# Altium schematic sheet VREG_CCU_HAS.SchDoc: CCU - Voltage Regulation
size B; DrawnBy: M. Seago; Organization: Gravitas; Address1: Sponsored By:; Address2: Alan Morgan; Address3: Technical Advisor:; Address4: Dr. Joseph Morgan; Revision: 1A; SheetNumber: 2; SheetTotal: 9
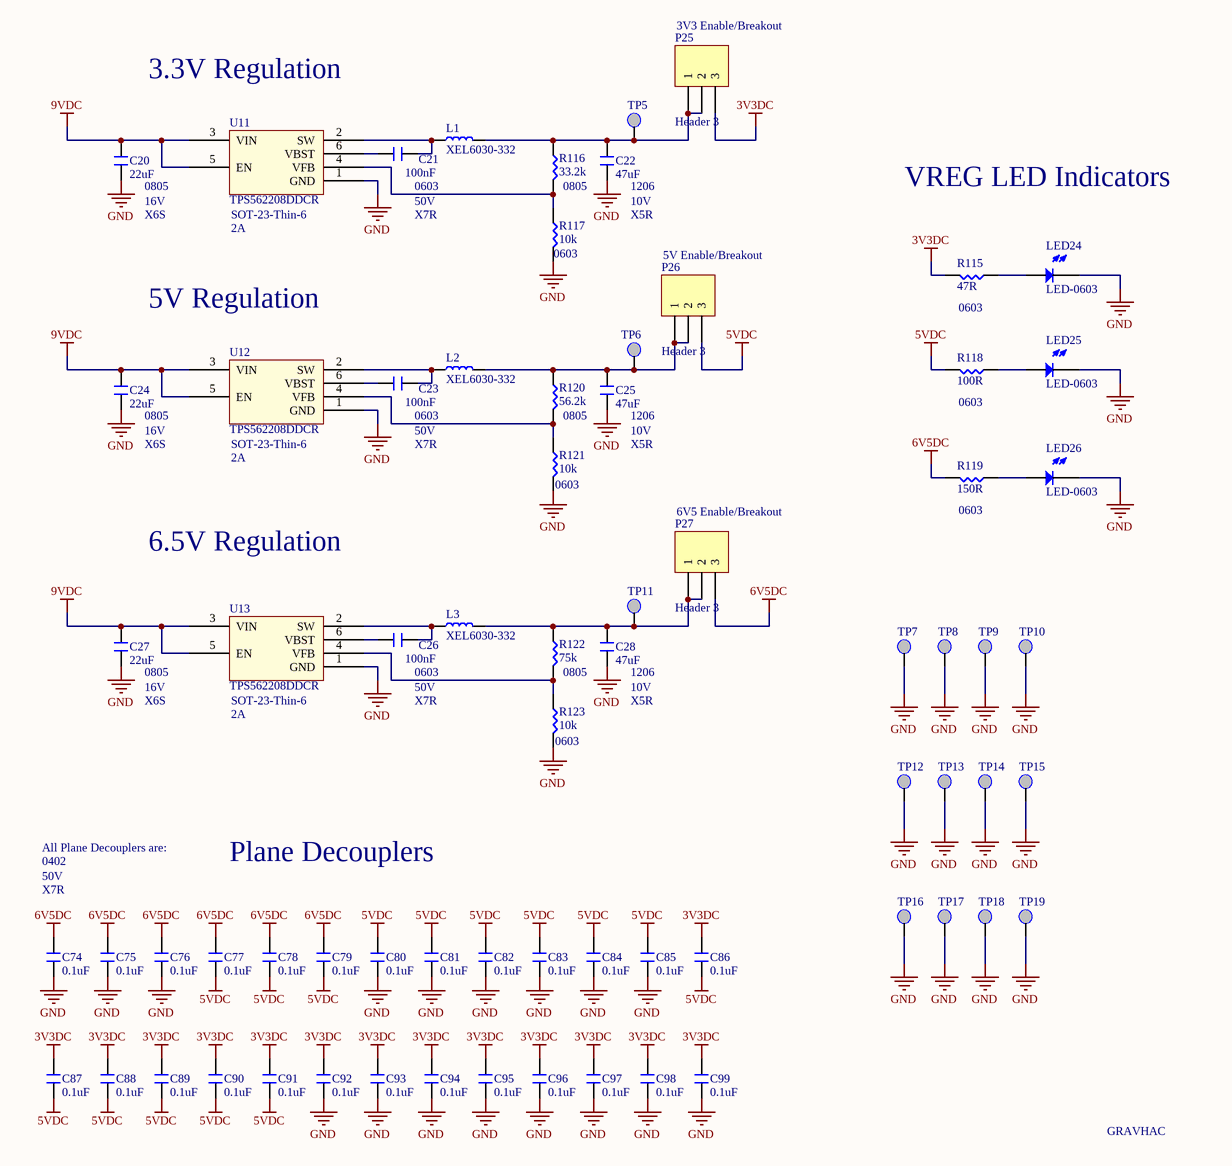
[diagram p0: VREG_CCU_HAS.SchDoc]

## Parts
C20  22uF  [NonPolar-0805]
C21  100nF  [NonPolar-0603]
C22  47uF  [NONPOLAR-1206]
C23  100nF  [NonPolar-0603]
C24  22uF  [NonPolar-0805]
C25  47uF  [NONPOLAR-1206]
C26  100nF  [NonPolar-0603]
C27  22uF  [NonPolar-0805]
C28  47uF  [NONPOLAR-1206]
C74  0.1uF  [NonPolar-0402]
C75  0.1uF  [NonPolar-0402]
C76  0.1uF  [NonPolar-0402]
C77  0.1uF  [NonPolar-0402]
C78  0.1uF  [NonPolar-0402]
C79  0.1uF  [NonPolar-0402]
C80  0.1uF  [NonPolar-0402]
C81  0.1uF  [NonPolar-0402]
C82  0.1uF  [NonPolar-0402]
C83  0.1uF  [NonPolar-0402]
C84  0.1uF  [NonPolar-0402]
C85  0.1uF  [NonPolar-0402]
C86  0.1uF  [NonPolar-0402]
C87  0.1uF  [NonPolar-0402]
C88  0.1uF  [NonPolar-0402]
C89  0.1uF  [NonPolar-0402]
C90  0.1uF  [NonPolar-0402]
C91  0.1uF  [NonPolar-0402]
C92  0.1uF  [NonPolar-0402]
C93  0.1uF  [NonPolar-0402]
C94  0.1uF  [NonPolar-0402]
C95  0.1uF  [NonPolar-0402]
C96  0.1uF  [NonPolar-0402]
C97  0.1uF  [NonPolar-0402]
C98  0.1uF  [NonPolar-0402]
C99  0.1uF  [NonPolar-0402]
L1  XEL6030-332  [XEL6030-33uH]
L2  XEL6030-332  [XEL6030-33uH]
L3  XEL6030-332  [XEL6030-33uH]
LED24  LED-0603  [LED-0603]
LED25  LED-0603  [LED-0603]
LED26  LED-0603  [LED-0603]
P25  Header 3  [HDR1X3]
P26  Header 3  [HDR1X3]
P27  Header 3  [HDR1X3]
R115  47R  [NonPolar-0603]
R116  33.2k  [NonPolar-0805]
R117  10k  [NonPolar-0603]
R118  100R  [NonPolar-0603]
R119  150R  [NonPolar-0603]
R120  56.2k  [NonPolar-0805]
R121  10k  [NonPolar-0603]
R122  75k  [NonPolar-0805]
R123  10k  [NonPolar-0603]
TP5  TestPoint  [TP - S2751-46R]  (value not drawn)
TP6  TestPoint  [TP - S2751-46R]  (value not drawn)
TP7  TestPoint  [TP - S2751-46R]  (value not drawn)
TP8  TestPoint  [TP - S2751-46R]  (value not drawn)
TP9  TestPoint  [TP - S2751-46R]  (value not drawn)
TP10  TestPoint  [TP - S2751-46R]  (value not drawn)
TP11  TestPoint  [TP - S2751-46R]  (value not drawn)
TP12  TestPoint  [TP - S2751-46R]  (value not drawn)
TP13  TestPoint  [TP - S2751-46R]  (value not drawn)
TP14  TestPoint  [TP - S2751-46R]  (value not drawn)
TP15  TestPoint  [TP - S2751-46R]  (value not drawn)
TP16  TestPoint  [TP - S2751-46R]  (value not drawn)
TP17  TestPoint  [TP - S2751-46R]  (value not drawn)
TP18  TestPoint  [TP - S2751-46R]  (value not drawn)
TP19  TestPoint  [TP - S2751-46R]  (value not drawn)
U11  TPS562208DDCR  [TPS562208DDCR]
U12  TPS562208DDCR  [TPS562208DDCR]
U13  TPS562208DDCR  [TPS562208DDCR]

## Nets
3V3DC: C86.2 C87.2 C88.2 C89.2 C90.2 C91.2 C92.2 C93.2 C94.2 C95.2 C96.2 C97.2 C98.2 C99.2 P25.3 R115.1
5VDC: C77.1 C78.1 C79.1 C80.2 C81.2 C82.2 C83.2 C84.2 C85.2 C86.1 C87.1 C88.1 C89.1 C90.1 C91.1 P26.3 R118.1
6V5DC: C74.2 C75.2 C76.2 C77.2 C78.2 C79.2 P27.3 R119.1
9VDC: C20.2 C24.2 C27.2 U11.3(VIN) U11.5(EN) U12.3(VIN) U12.5(EN) U13.3(VIN) U13.5(EN)
GND: C20.1 C22.1 C24.1 C25.1 C27.1 C28.1 C74.1 C75.1 C76.1 C80.1 C81.1 C82.1 C83.1 C84.1 C85.1 C92.1 C93.1 C94.1 C95.1 C96.1 C97.1 C98.1 C99.1 LED24.2 LED25.2 LED26.2 R117.1 R121.1 R123.1 TP7.1 TP8.1 TP9.1 TP10.1 TP12.1 TP13.1 TP14.1 TP15.1 TP16.1 TP17.1 TP18.1 TP19.1 U11.1(GND) U12.1(GND) U13.1(GND)
NetC21_1: C21.1 U11.6(VBST)
NetC21_2: C21.2 L1.1 U11.2(SW)
NetC22_2: C22.2 L1.2 P25.1 P25.2 R116.2 TP5.1
NetC23_1: C23.1 U12.6(VBST)
NetC23_2: C23.2 L2.1 U12.2(SW)
NetC25_2: C25.2 L2.2 P26.1 P26.2 R120.2 TP6.1
NetC26_1: C26.1 U13.6(VBST)
NetC26_2: C26.2 L3.1 U13.2(SW)
NetC28_2: C28.2 L3.2 P27.1 P27.2 R122.2 TP11.1
NetLED24_1: LED24.1 R115.2
NetLED25_1: LED25.1 R118.2
NetLED26_1: LED26.1 R119.2
NetR116_1: R116.1 R117.2 U11.4(VFB)
NetR120_1: R120.1 R121.2 U12.4(VFB)
NetR122_1: R122.1 R123.2 U13.4(VFB)

## Notes on the sheet
- (near P25) 3V3 Enable/Breakout
- 3.3V Regulation
- (near C20) 0805
- (near C20) 16V
- 0603
- 50V
- (near R116) 0805
- (near C22) 1206
- (near C22) 10V
- VREG LED Indicators
- X6S
- (near U11) SOT-23-Thin-6
- (near U11) 2A
- X7R
- (near R117) 0603
- X5R
- (near P26) 5V Enable/Breakout
- 5V Regulation
- (near R115) 0603
- (near R118) 0603
- (near C24) 0805
- (near C24) 16V
- (near U12) SOT-23-Thin-6
- (near U12) 2A
- (near R120) 0805
- (near C25) 1206
- (near C25) 10V
- (near R121) 0603
- (near P27) 6V5 Enable/Breakout
- (near R119) 0603
- 6.5V Regulation
- (near C27) 0805
- (near R122) 0805
- (near C28) 1206
- (near C27) 16V
- (near U13) SOT-23-Thin-6
- (near U13) 2A
- (near R123) 0603
- (near C28) 10V
- 0402
- All Plane Decouplers are:
- Plane Decouplers
- GRAVHAC
- Title
- Size:
- Date:
- B
- Drawn By:
- Revision:
- Sheet
- of
- File:

## Library data of the parts
C20 C24 C27 = Cap - 0805
C21 C23 C26 = Cap - 0603
C22 C25 C28 = Cap - 1206
C74-C99 = Cap - 0402
P25-P27 = Header 3: Header, 3-Pin; LatestRevisionDate: 17-Jul-2002; LatestRevisionNote: Re-released for DXP Platform.; Publisher: Altium Limited
R115 R117-R119 R121 R123 = Res - 0603
R116 R120 R122 = Res - 0805
TP5-TP19 = TestPoint: S2751-46R
U11-U13 = TPS562208DDCR: 4.5V to 17V Input, 2A Output, Synchronous Step-Down Converter